# EAGLE design M8340X2 (EAGLE 6.6.0)
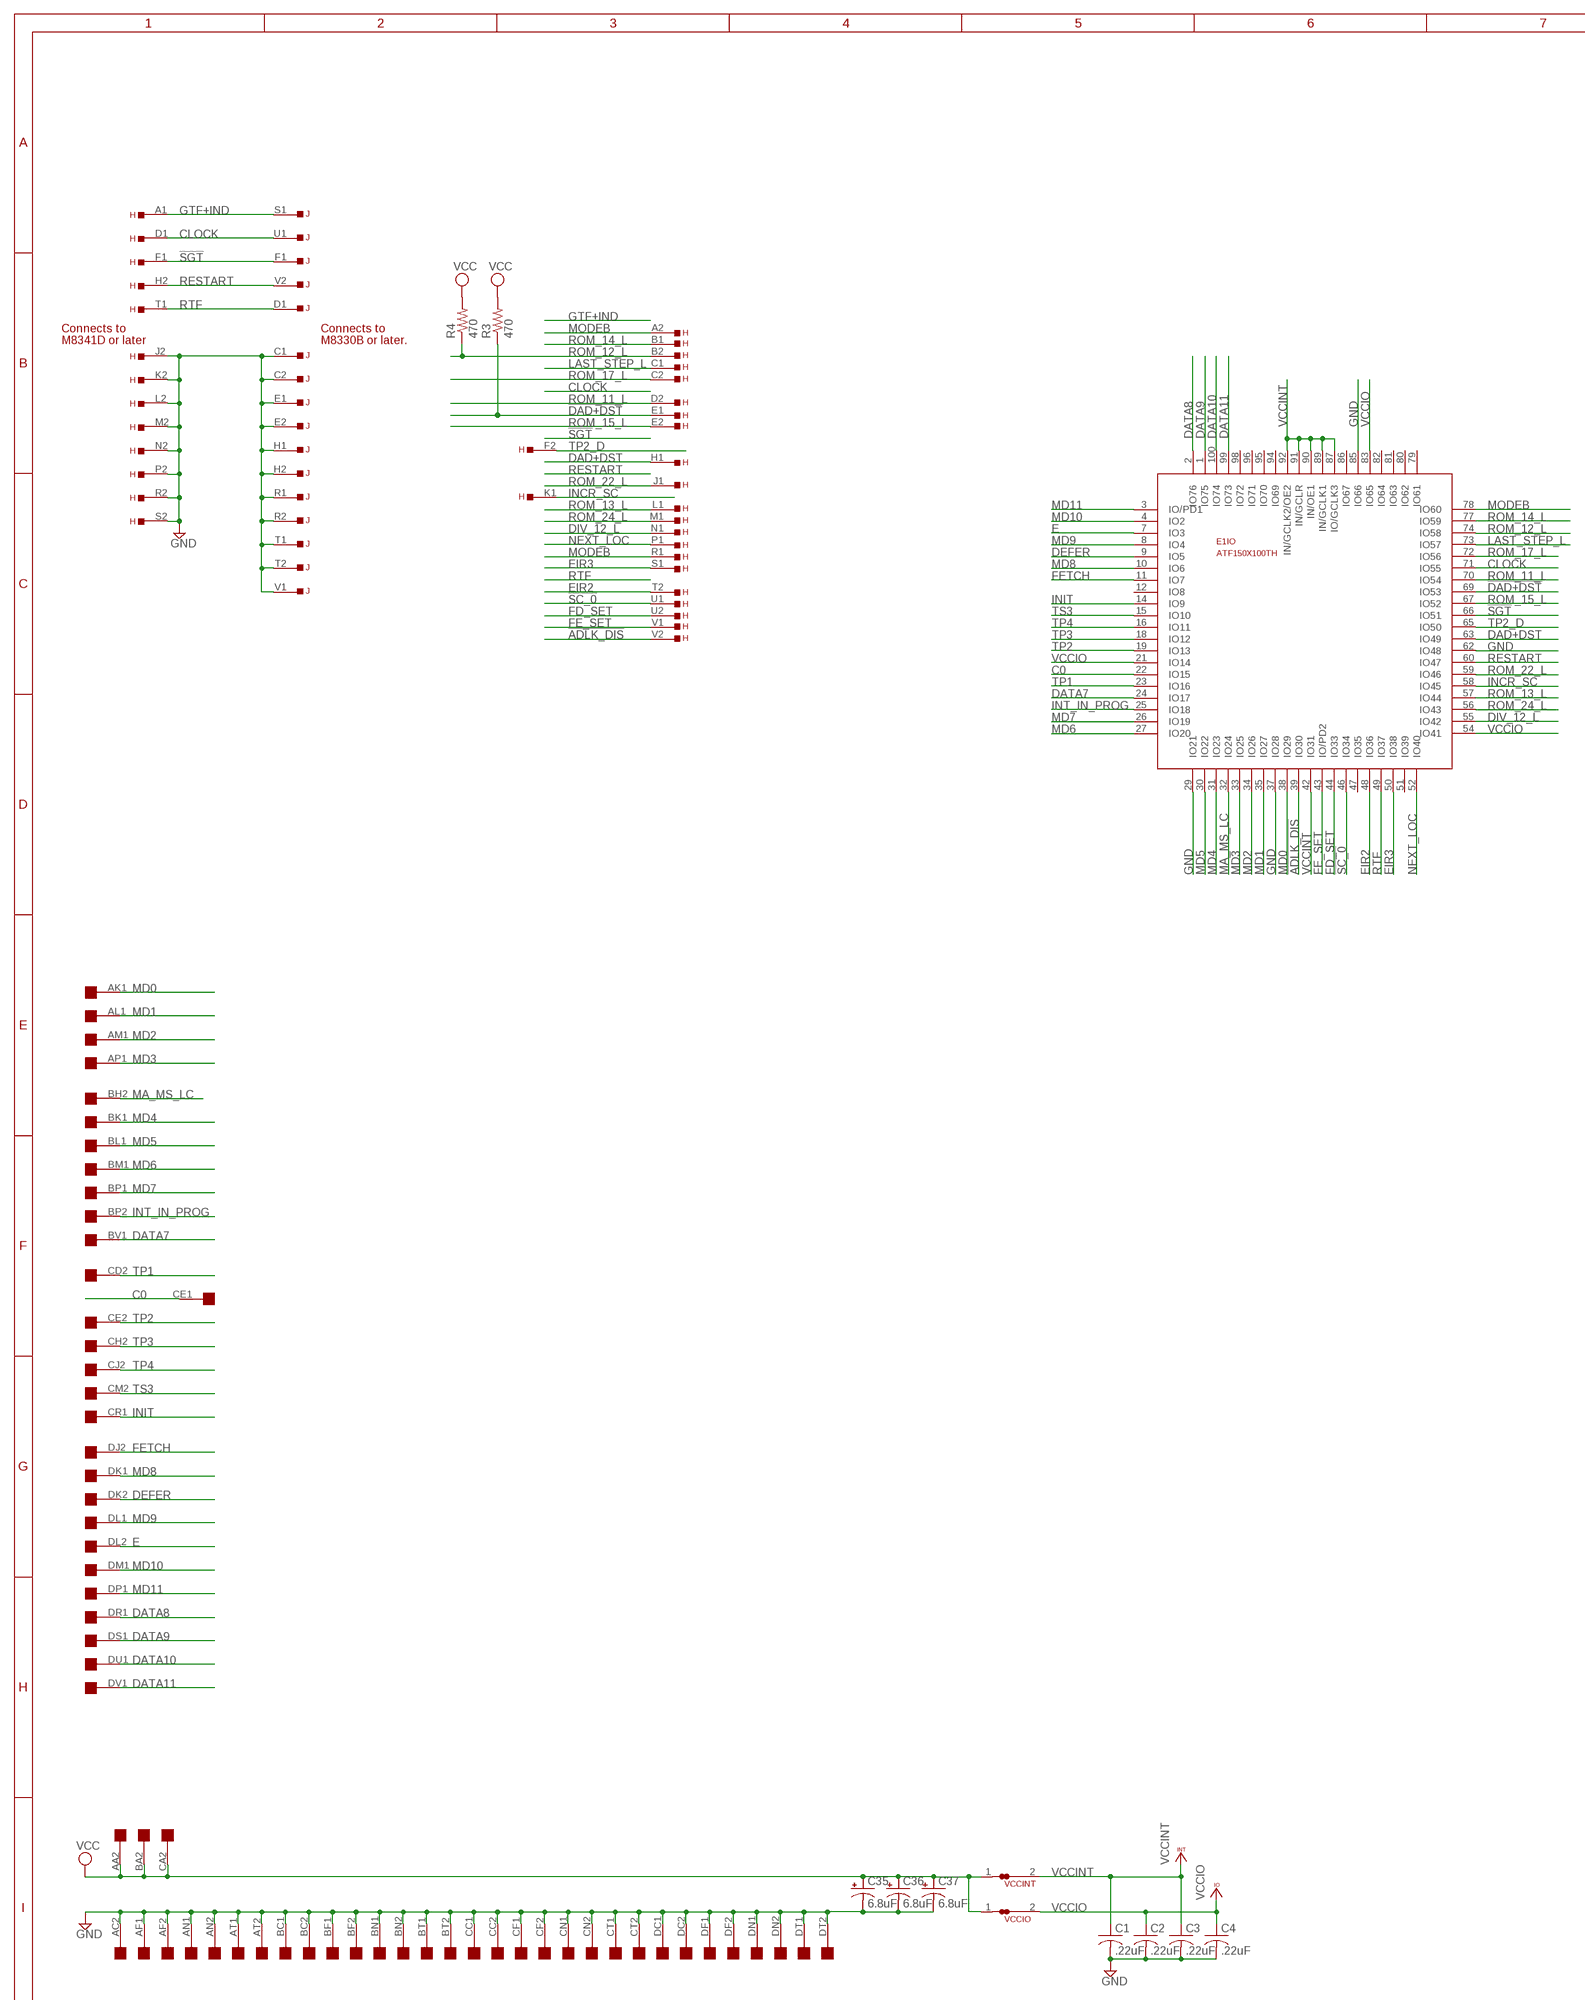
[diagram p0: schematic, sheet 1, part 1 of 2]
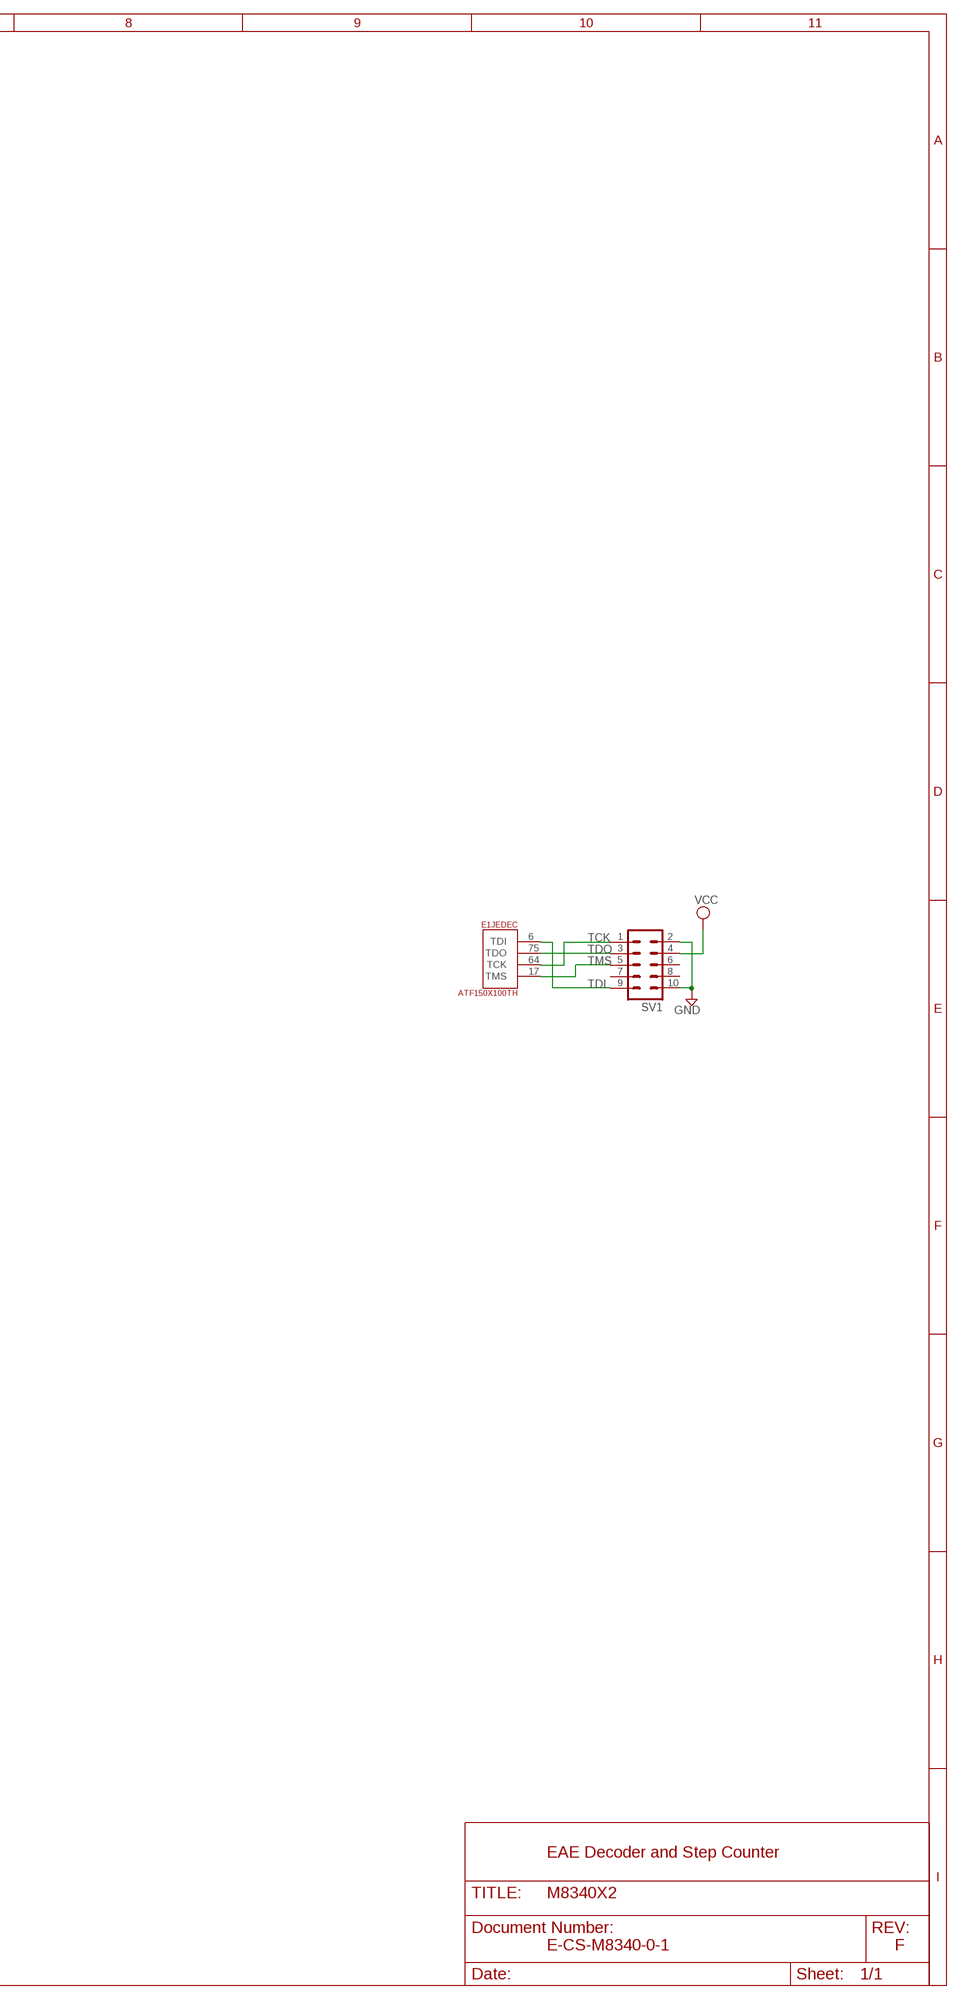
[diagram p1: schematic, sheet 1, part 2 of 2]

## Parts
C1  .22uF  C-US  [C063-025X075]
C2  .22uF  C-US  [C063-025X075]
C3  .22uF  C-US  [C063-025X075]
C4  .22uF  C-US  [C063-025X075]
C35  6.8uF  CPOL-USE20-8AXIAL  [E12-8]
C36  6.8uF  CPOL-USE20-8AXIAL  [E12-8]
C37  6.8uF  CPOL-USE20-8AXIAL  [E12-8]
E1  ATF150X100TH  [TH-100]
H  EDGE-TOP  [EDGE-CON2]
J  EDGE-TOP  [EDGE-CON2]
R3  470  R-US_0207/10  [0207/10]
R4  470  R-US_0207/10  [0207/10]
SV1  ML10  [ML10]
U$1  QUAD  [EDGE-CON8]
VCCINT  JUMPER-NC1  [NC1]
VCCIO  JUMPER-NC1  [NC1]

## Nets
!ADLK_DIS: E1.39(IO:IO30) H.V2
!DAD+DST: E1.69(IO:IO53) H.E1 R3.1
!SC_0: E1.46(IO:IO34) H.U1
!SGT: E1.66(IO:IO51) H.F1 J.F1
C0: E1.22(IO:IO15) U$1.CE1
CLOCK: E1.71(IO:IO55) H.D1 J.U1
DAD+DST: E1.63(IO:IO49) H.H1
DATA7: E1.24(IO:IO17) U$1.BV1
DATA8: E1.2(IO:IO76) U$1.DR1
DATA9: E1.1(IO:IO75) U$1.DS1
DATA10: E1.100(IO:IO74) U$1.DU1
DATA11: E1.99(IO:IO73) U$1.DV1
DEFER: E1.9(IO:IO5) U$1.DK2
DIV_12_L: E1.55(IO:IO42) H.N1
E: E1.7(IO:IO3) U$1.DL2
EIR2: E1.48(IO:IO36) H.T2
EIR3: E1.50(IO:IO38) H.S1
FD_SET: E1.44(IO:IO33) H.U2
FE_SET: E1.43(IO:IO/PD2) H.V1
FETCH: E1.11(IO:IO7) U$1.DJ2
GND [supply]: C1.2 C2.2 C3.2 C4.2 C35.- C36.- C37.- E1.29(IO:IO21) E1.37(IO:IO28) E1.62(IO:IO48) E1.85(IO:IO66) H.J2 H.K2 H.L2 H.M2 H.N2 H.P2 H.R2 H.S2 J.C1 J.C2 J.E1 J.E2 J.H1 J.H2 J.R1 J.R2 J.T1 J.T2 J.V1 SV1.2 SV1.10 U$1.AC2 U$1.AF1 U$1.AF2 U$1.AN1 U$1.AN2 U$1.AT1 U$1.AT2 U$1.BC1 U$1.BC2 U$1.BF1 U$1.BF2 U$1.BN1 U$1.BN2 U$1.BT1 U$1.BT2 U$1.CC1 U$1.CC2 U$1.CF1 U$1.CF2 U$1.CN1 U$1.CN2 U$1.CT1 U$1.CT2 U$1.DC1 U$1.DC2 U$1.DF1 U$1.DF2 U$1.DN1 U$1.DN2 U$1.DT1 U$1.DT2
GTF+IND: H.A1 J.S1
INCR_SC: E1.58(IO:IO45) H.K1
INIT: E1.14(IO:IO9) U$1.CR1
INT_IN_PROG: E1.25(IO:IO18) U$1.BP2
LAST_STEP_L: E1.73(IO:IO57) H.C1
MA_MS_LC: E1.32(IO:IO24) U$1.BH2
MD0: E1.38(IO:IO29) U$1.AK1
MD1: E1.35(IO:IO27) U$1.AL1
MD2: E1.34(IO:IO26) U$1.AM1
MD3: E1.33(IO:IO25) U$1.AP1
MD4: E1.31(IO:IO23) U$1.BK1
MD5: E1.30(IO:IO22) U$1.BL1
MD6: E1.27(IO:IO20) U$1.BM1
MD7: E1.26(IO:IO19) U$1.BP1
MD8: E1.10(IO:IO6) U$1.DK1
MD9: E1.8(IO:IO4) U$1.DL1
MD10: E1.4(IO:IO2) U$1.DM1
MD11: E1.3(IO:IO/PD1) U$1.DP1
MODEB: E1.78(IO:IO60) H.A2 H.R1
NEXT_LOC: E1.52(IO:IO40) H.P1
RESTART: E1.60(IO:IO47) H.H2 J.V2
ROM_11_L: E1.70(IO:IO54) H.D2
ROM_12_L: E1.74(IO:IO58) H.B2 R4.1
ROM_13_L: E1.57(IO:IO44) H.L1
ROM_14_L: E1.77(IO:IO59) H.B1
ROM_15_L: E1.67(IO:IO52) H.E2
ROM_17_L: E1.72(IO:IO56) H.C2
ROM_22_L: E1.59(IO:IO46) H.J1
ROM_24_L: E1.56(IO:IO43) H.M1
RTF: E1.49(IO:IO37) H.T1 J.D1
TCK: E1.64(JEDEC:TCK) SV1.1
TDI: E1.6(JEDEC:TDI) SV1.9
TDO: E1.75(JEDEC:TDO) SV1.3
TMS: E1.17(JEDEC:TMS) SV1.5
TP1: E1.23(IO:IO16) U$1.CD2
TP2: E1.19(IO:IO13) U$1.CE2
TP2_D: E1.65(IO:IO50) H.F2
TP3: E1.18(IO:IO12) U$1.CH2
TP4: E1.16(IO:IO11) U$1.CJ2
TS3: E1.15(IO:IO10) U$1.CM2
VCC [supply]: C35.+ C36.+ C37.+ R3.2 R4.2 SV1.4 U$1.AA2 U$1.BA2 U$1.CA2 VCCINT.1 VCCIO.1
VCCINT: C1.1 C3.1 E1.42(IO:IO31) E1.87(IO:IO/GCLK3) E1.89(IO:IN/GCLK1) E1.90(IO:IN/OE1) E1.91(IO:IN/GCLR) E1.92(IO:IN/GCLK2/OE2) VCCINT.2
VCCIO: C2.1 C4.1 E1.21(IO:IO14) E1.54(IO:IO41) E1.83(IO:IO65) VCCIO.2
Unconnected: E1.12(IO:IO8) E1.47(IO:IO35) E1.51(IO:IO39) E1.79(IO:IO61) E1.80(IO:IO62) E1.81(IO:IO63) E1.82(IO:IO64) E1.86(IO:IO67) E1.94(IO:IO69) E1.95(IO:IO70) E1.96(IO:IO71) E1.98(IO:IO72) J.A1 J.A2 J.B1 J.B2 J.D2 J.F2 J.J1 J.J2 J.K1 J.K2 J.L1 J.L2 J.M1 J.M2 J.N1 J.N2 J.P1 J.P2 J.S2 J.U2 SV1.6 SV1.7 SV1.8 U$1.AA1 U$1.AB1 U$1.AB2 U$1.AC1 U$1.AD1 U$1.AD2 U$1.AE1 U$1.AE2 U$1.AH1 U$1.AH2 U$1.AJ1 U$1.AJ2 U$1.AK2 U$1.AL2 U$1.AM2 U$1.AP2 U$1.AR1 U$1.AR2 U$1.AS1 U$1.AS2 U$1.AU1 U$1.AU2 U$1.AV1 U$1.AV2 U$1.BA1 U$1.BB1 U$1.BB2 U$1.BD1 U$1.BD2 U$1.BE1 U$1.BE2 U$1.BH1 U$1.BJ1 U$1.BJ2 U$1.BK2 U$1.BL2 U$1.BM2 U$1.BR1 U$1.BR2 U$1.BS1 U$1.BS2 U$1.BU1 U$1.BU2 U$1.BV2 U$1.CA1 U$1.CB1 U$1.CB2 U$1.CD1 U$1.CH1 U$1.CJ1 U$1.CK1 U$1.CK2 U$1.CL1 U$1.CL2 U$1.CM1 U$1.CP1 U$1.CP2 U$1.CR2 U$1.CS1 U$1.CS2 U$1.CU1 U$1.CU2 U$1.CV1 U$1.CV2 U$1.DA1 U$1.DA2 U$1.DB1 U$1.DB2 U$1.DD1 U$1.DD2 U$1.DE1 U$1.DE2 U$1.DH1 U$1.DH2 U$1.DJ1 U$1.DM2 U$1.DP2 U$1.DR2 U$1.DS2 U$1.DU2 U$1.DV2

## Notes on the sheet
- Connects to | Connects to
- M8341D or later | M8330B or later.
- EAE Decoder and Step Counter
- E-CS-M8340-0-1 | F

## Power pins joined to a net without a drawn wire
GND: E1.13(GND) E1.28(GND) E1.40(GND) E1.45(GND) E1.61(GND) E1.76(GND) E1.88(GND) E1.97(GND)
VCCINT: E1.41(VCCINT) E1.93(VCCINT)
VCCIO: E1.5(VCCIO) E1.20(VCCIO) E1.36(VCCIO) E1.53(VCCIO) E1.68(VCCIO) E1.84(VCCIO)

## Library data of the parts
C1-C4 = dec-con:C-US: Capacitors with funky DEC lead spacing.
C35-C37 = dec-con:CPOL-USE20-8AXIAL: A 0.8 inch electrolytic.
E1 = atmel-cpld:ATF150X100: ATF150x in 100 pin package.
H J = dec-con:EDGE-TOP: Labeled DEC edge connector, suitable for top connector.
R3 R4 = rcl:R-US_: RESISTOR, American symbol
SV1 = con-harting-ml:ML10: HARTING; OC_FARNELL: unknown; OC_NEWARK: unknown
U$1 = dec-con:QUAD: Quad-Height DEC board
VCCINT VCCIO = dec-con:JUMPER: Normally closed SMD Jumper (Generates a DRC error.)

## Net classes
0 default: width 0.406 mm
1 supply: width 0.61 mm

## Board
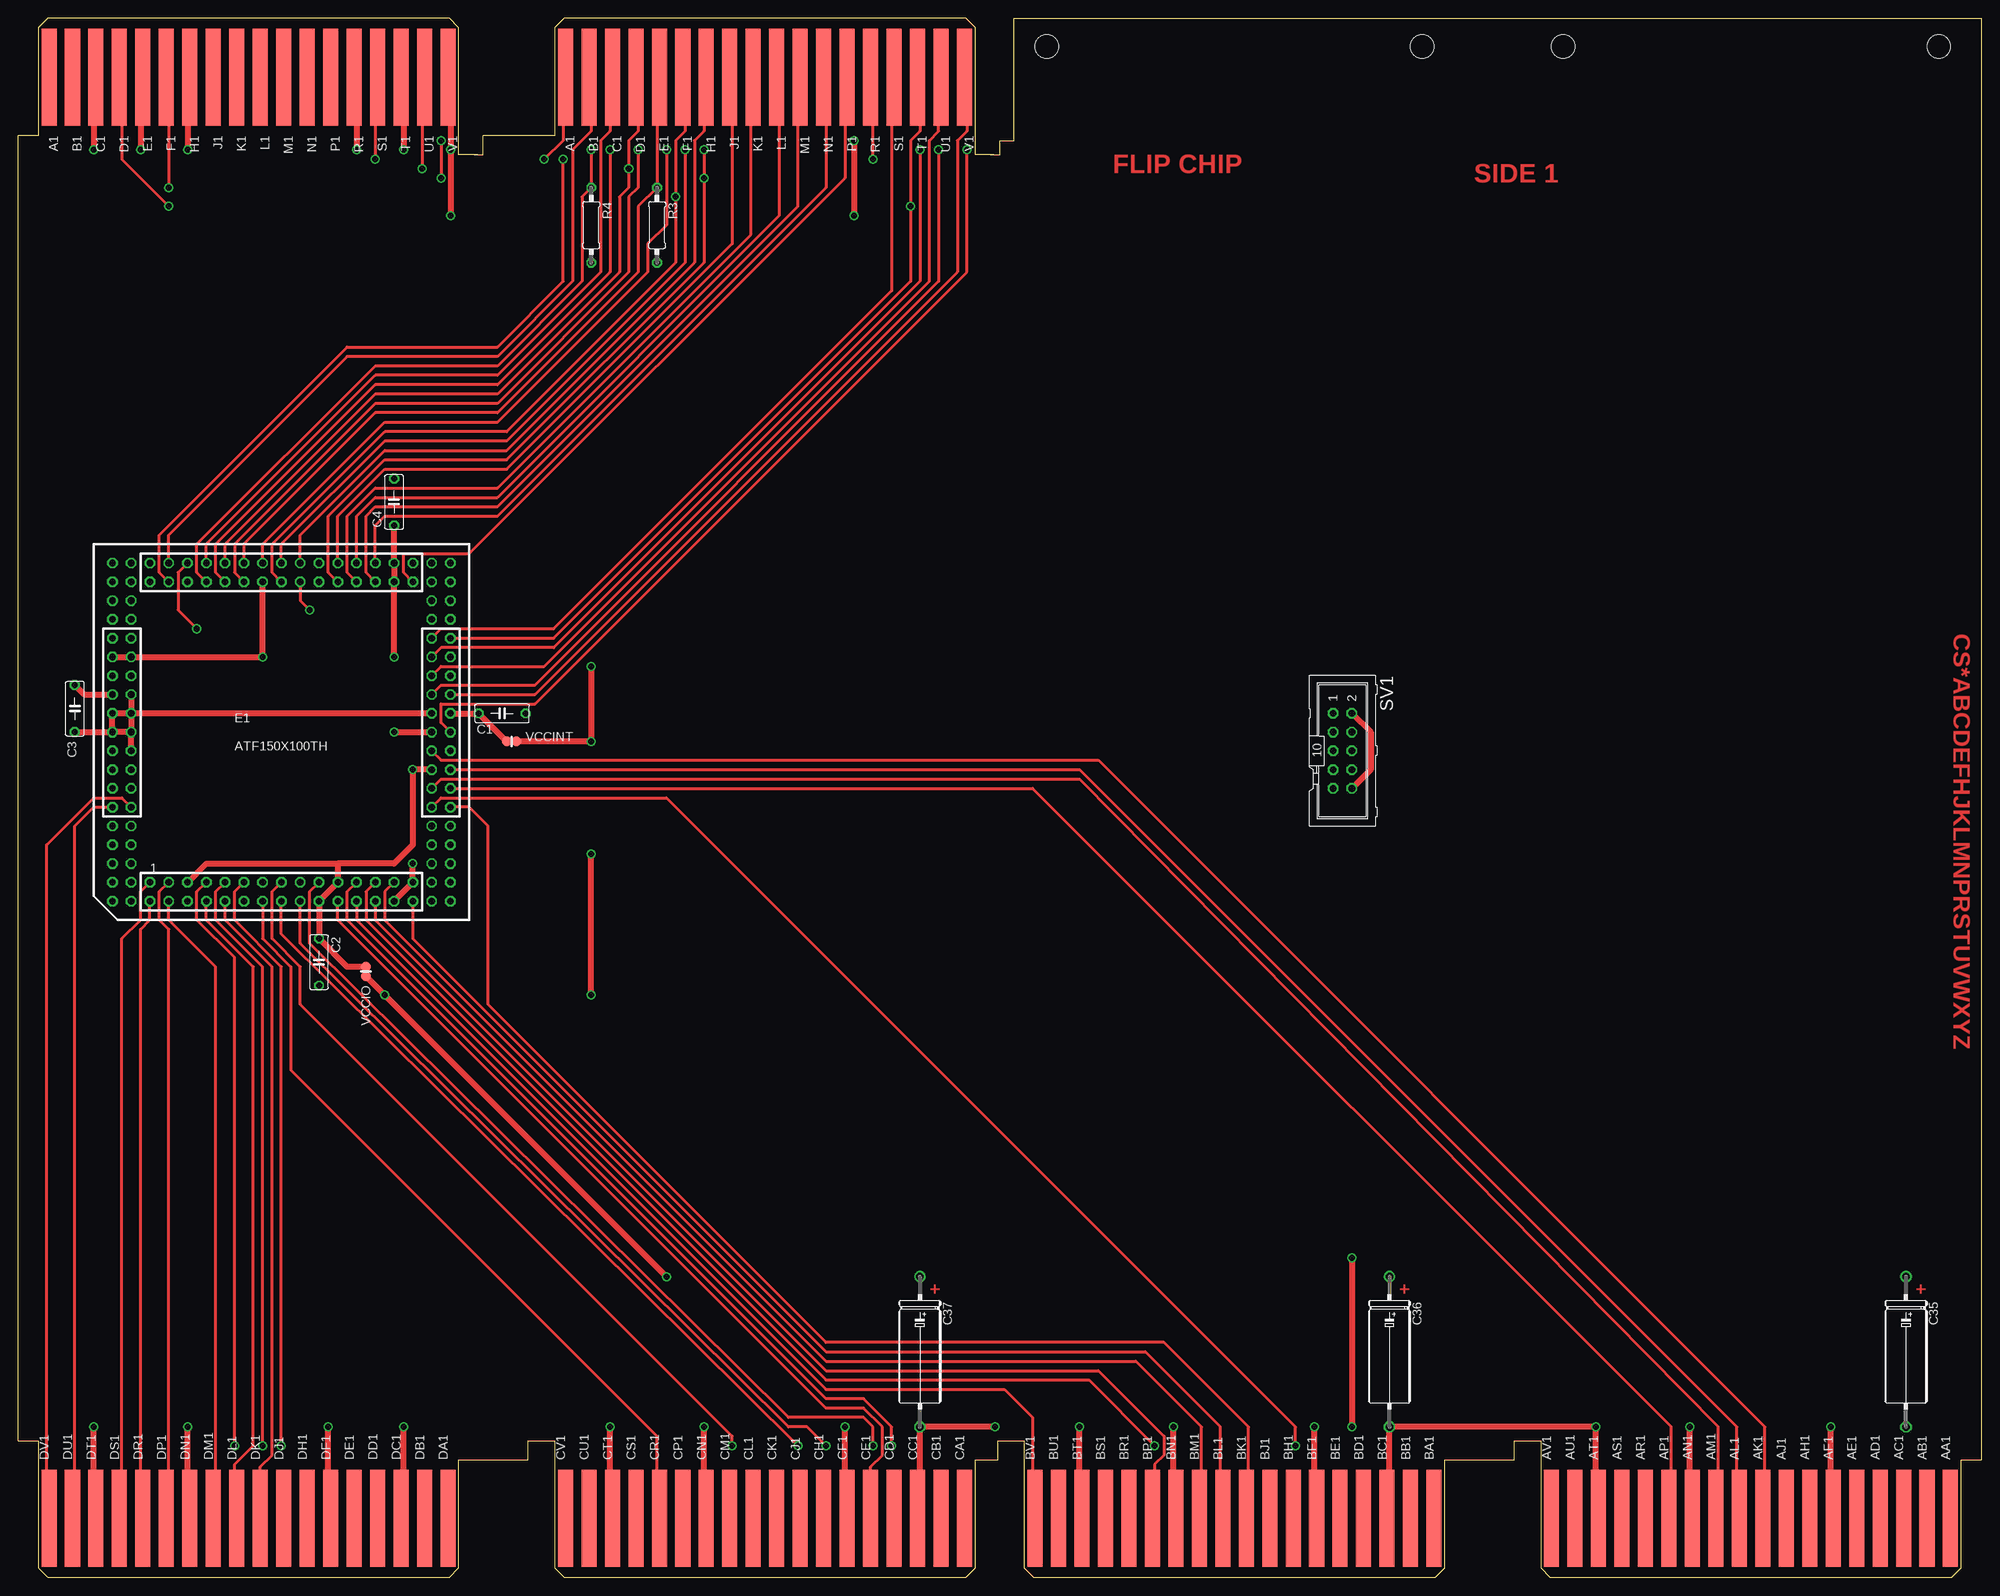
[diagram p2: board, top side]
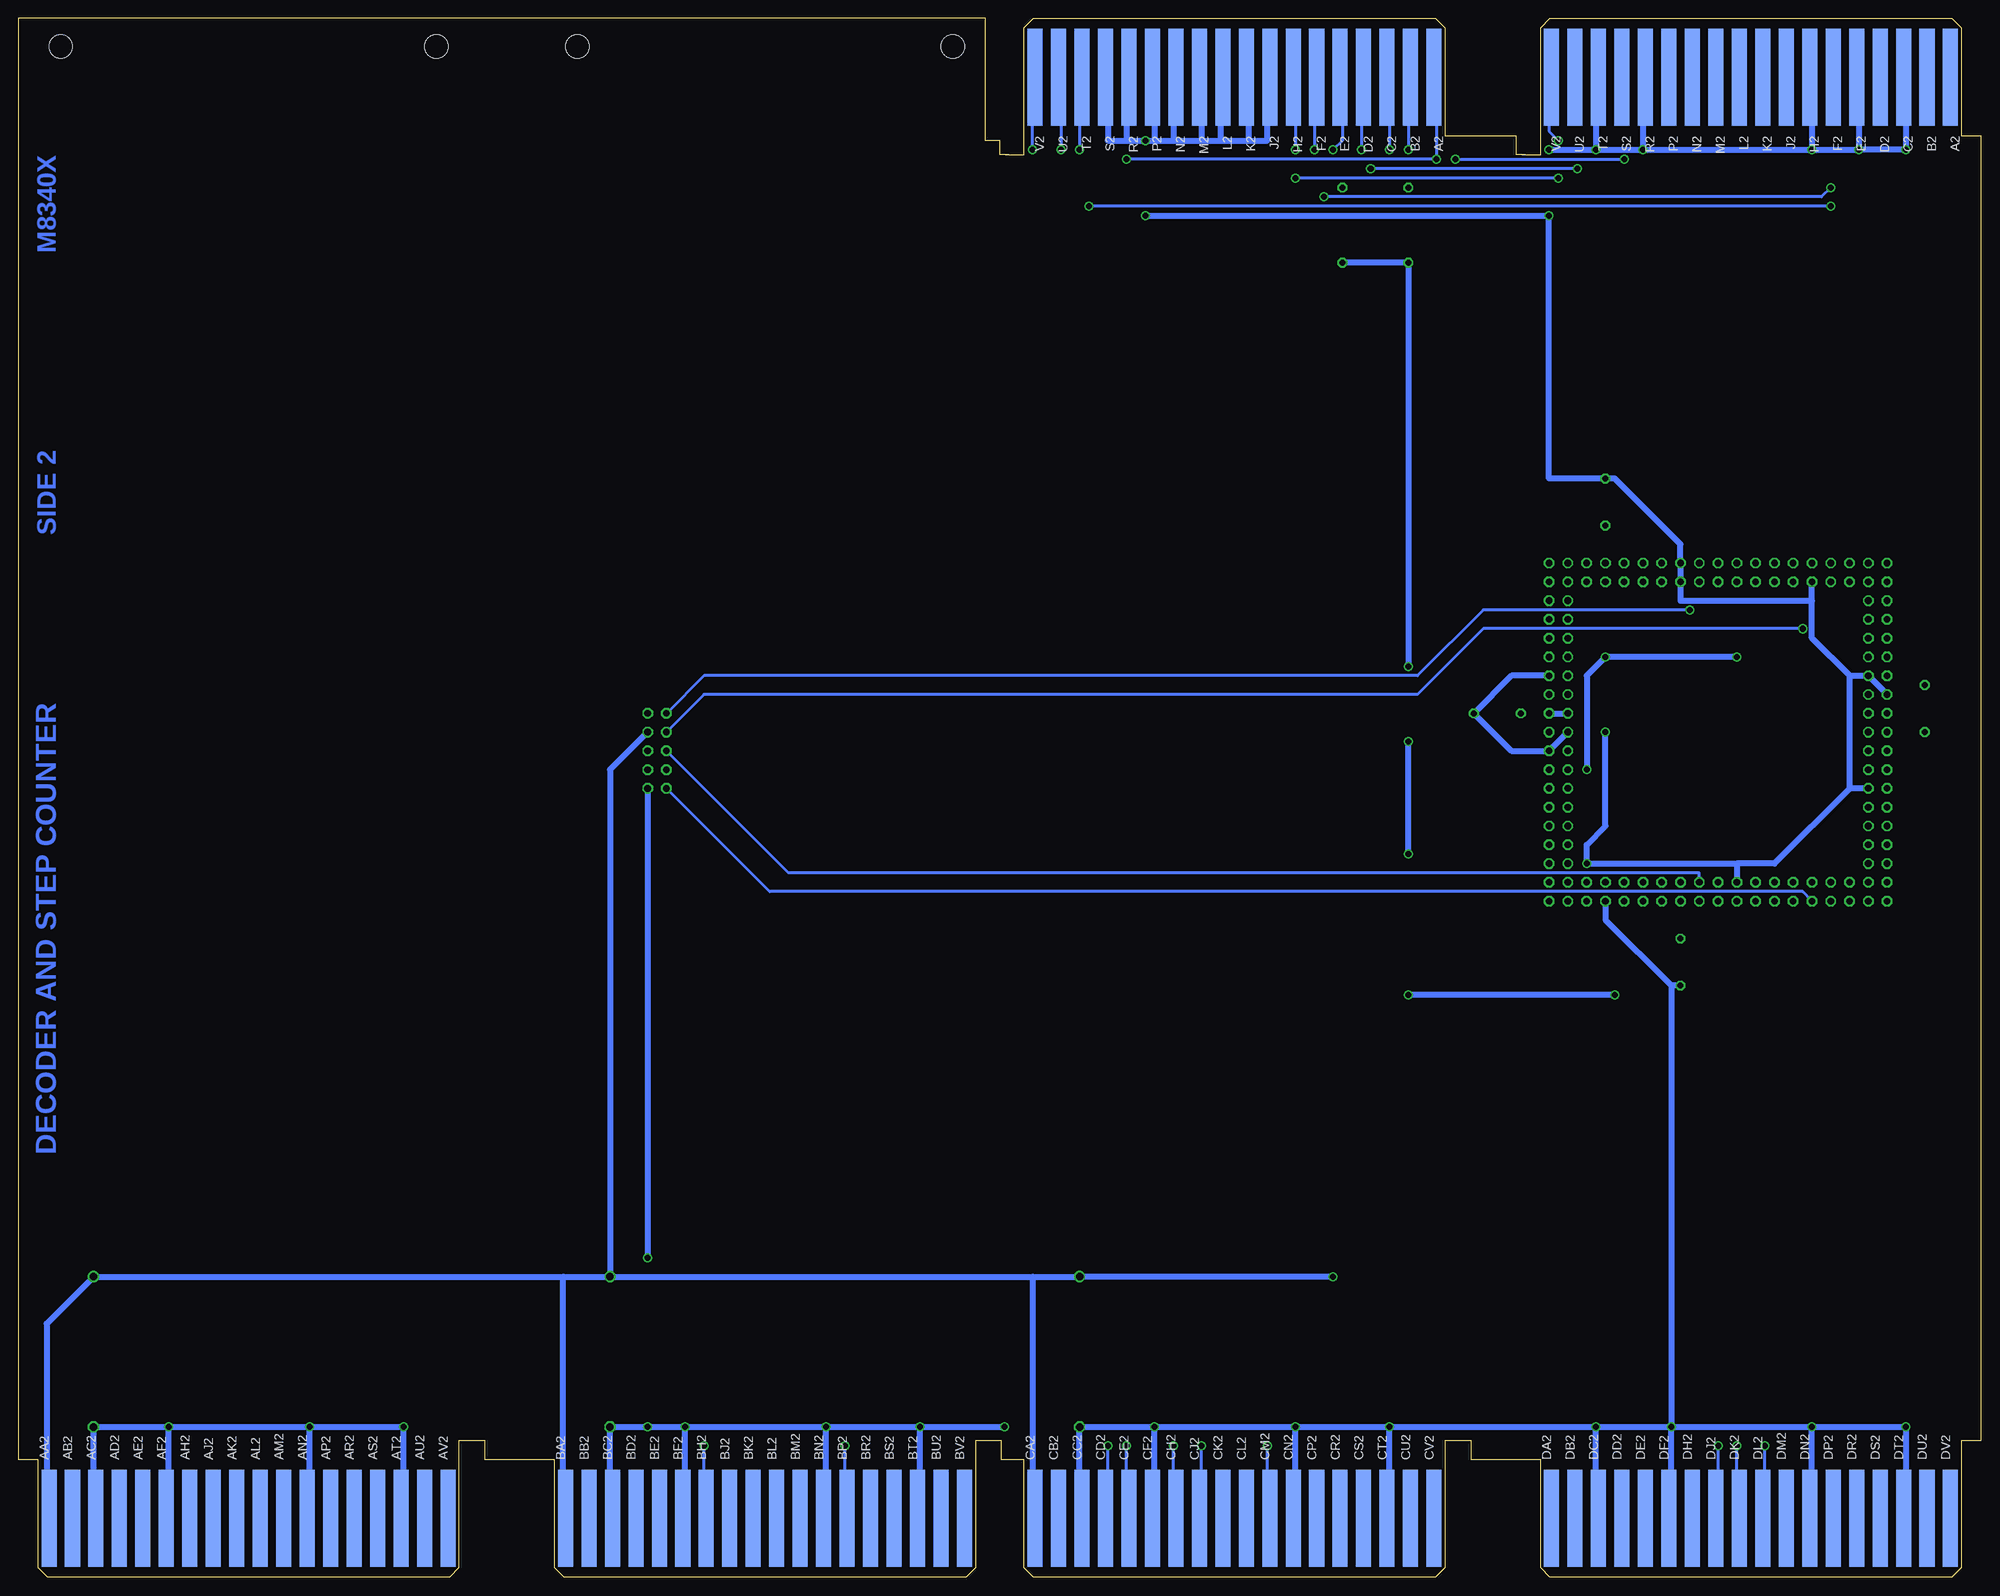
[diagram p3: board, bottom side, seen from below]

Size 265.43 x 210.82 mm. Coordinates in mm from the lower left corner, seen from the top.
Outline: 61.59,192.41 62.87,192.41 62.87,194.94 69.85,194.94
Outline: 131.44,192.41 132.72,192.41 132.72,194.31 134.62,194.31 134.62,210.82 265.43,210.82 265.43,15.88
Outline: 0,194.94 0,18.41 0.64,18.41
Copper layers (1+16): Top 0.035mm / dielectric 1.5mm / Bottom 0.035mm
Design rules "16mils": minimum track width 16mil, minimum drill 32mil, track to track 15mil, track to pad 10mil, pad to pad 10mil, via to via 10mil, smd to smd 10mil, copper to edge 13mil, drill to drill 10mil, minimum pad ring 10mil, minimum via ring 8mil, stop-mask expansion 0mil, vias tented up to drill 0mil, thermal gap 10mil
Holes 3.2 mm at 139.06,207.01 189.87,207.01 208.91,207.01 259.71,207.01

### Footprints (pad centres in the part's own frame; a part is rotated, then mirrored left to right if it is on the bottom)
C063-025X075 = drill 0.813 octagon: 1 -2.54,0; 2 3.81,0
E12-8 = drill 1.016: + -10.16,0 | drill 1.016 octagon: - 10.16,0
TH-100 = drill 0.9 octagon: 1 -17.78,-20.32; 2 -17.78,-22.86; 3 -15.24,-20.32; 4 -15.24,-22.86; 5 -12.7,-20.32; 6 -12.7,-22.86; 7 -10.16,-20.32; 8 -10.16,-22.86; 9 -7.62,-20.32; 10 -7.62,-22.86; 11 -5.08,-20.32; 12 -5.08,-22.86; 13 -2.54,-20.32; 14 -2.54,-22.86; 15 0,-20.32; 16 0,-22.86; 17 2.54,-20.32; 18 2.54,-22.86; 19 5.08,-20.32; 20 5.08,-22.86; 21 7.62,-20.32; 22 7.62,-22.86; 23 10.16,-20.32; 24 10.16,-22.86; 25 12.7,-20.32; 26 12.7,-22.86; 27 15.24,-20.32; 28 15.24,-22.86; 29 17.78,-20.32; 30 17.78,-22.86; 31 22.86,-10.16; 32 20.32,-10.16; 33 22.86,-7.62; 34 20.32,-7.62; 35 22.86,-5.08; 36 20.32,-5.08; 37 22.86,-2.54; 38 20.32,-2.54; 39 22.86,0; 40 20.32,0; 41 22.86,2.54; 42 20.32,2.54; 43 22.86,5.08; 44 20.32,5.08; 45 22.86,7.62; 46 20.32,7.62; 47 22.86,10.16; 48 20.32,10.16; 49 22.86,12.7; 50 20.32,12.7; 51 17.78,22.86; 52 17.78,20.32; 53 15.24,22.86; 54 15.24,20.32; 55 12.7,22.86; 56 12.7,20.32; 57 10.16,22.86; 58 10.16,20.32; 59 7.62,22.86; 60 7.62,20.32; 61 5.08,22.86; 62 5.08,20.32; 63 2.54,22.86; 64 2.54,20.32; 65 0,22.86; 66 0,20.32; 67 -2.54,22.86; 68 -2.54,20.32; 69 -5.08,22.86; 70 -5.08,20.32; 71 -7.62,22.86; 72 -7.62,20.32; 73 -10.16,22.86; 74 -10.16,20.32; 75 -12.7,22.86; 76 -12.7,20.32; 77 -15.24,22.86; 78 -15.24,20.32; 79 -17.78,22.86; 80 -17.78,20.32; 81 -20.32,12.7; 82 -22.86,12.7; 83 -20.32,10.16; 84 -22.86,10.16; 85 -20.32,7.62; 86 -22.86,7.62; 87 -20.32,5.08; 88 -22.86,5.08; 89 -20.32,2.54; 90 -22.86,2.54; 91 -20.32,0; 92 -22.86,0; 93 -20.32,-2.54; 94 -22.86,-2.54; 95 -20.32,-5.08; 96 -22.86,-5.08; 97 -20.32,-7.62; 98 -22.86,-7.62; 99 -20.32,-10.16; 100 -22.86,-10.16; P$1 -22.86,15.24; P$2 -20.32,15.24; P$3 -20.32,17.78; P$4 -22.86,17.78; P$5 -20.32,20.32; P$6 -22.86,20.32; P$7 -22.86,22.86; P$8 -20.32,22.86; P$9 20.32,15.24; P$10 22.86,15.24; P$11 20.32,17.78; P$12 22.86,17.78; P$13 20.32,20.32; P$14 22.86,20.32; P$15 20.32,22.86; P$16 22.86,22.86; P$17 20.32,-17.78; P$18 22.86,-17.78; P$19 20.32,-15.24; P$20 22.86,-15.24; P$21 20.32,-12.7; P$22 22.86,-12.7; P$31 20.32,-22.86; P$32 22.86,-22.86; P$33 22.86,-20.32; P$34 20.32,-20.32; P$35 -20.32,-22.86; P$36 -20.32,-20.32; P$37 -22.86,-20.32; P$38 -22.86,-22.86; P$39 -22.86,-17.78; P$40 -20.32,-17.78; P$41 -22.86,-15.24; P$42 -20.32,-15.24; P$43 -22.86,-12.7; P$44 -20.32,-12.7
EDGE-CON2 = smd 13.106 x 2.032: A1 7.938,4.128; B1 7.938,7.303; C1 7.938,10.477; D1 7.938,13.652; E1 7.938,16.828; F1 7.938,20.003; H1 7.938,23.177; J1 7.938,26.352; K1 7.938,29.527; L1 7.938,32.703; M1 7.938,35.877; N1 7.938,39.053; P1 7.938,42.227; R1 7.938,45.403; S1 7.938,48.578; T1 7.938,51.752; U1 7.938,54.928; V1 7.938,58.102 | smd 13.106 x 2.032 bottom: A2 7.938,4.128; B2 7.938,7.303; C2 7.938,10.477; D2 7.938,13.652; E2 7.938,16.828; F2 7.938,20.003; H2 7.938,23.177; J2 7.938,26.352; K2 7.938,29.527; L2 7.938,32.703; M2 7.938,35.877; N2 7.938,39.053; P2 7.938,42.227; R2 7.938,45.403; S2 7.938,48.578; T2 7.938,51.752; U2 7.938,54.928; V2 7.938,58.102
0207/10 = drill 0.813 octagon: 1 -5.08,0; 2 5.08,0
ML10 = drill 0.914 octagon: 1 -5.08,-1.27; 2 -5.08,1.27; 3 -2.54,-1.27; 4 -2.54,1.27; 5 0,-1.27; 6 0,1.27; 7 2.54,-1.27; 8 2.54,1.27; 9 5.08,-1.27; 10 5.08,1.27
EDGE-CON8 = smd 2.032 x 13.106: AA1 261.303,7.938; AB1 258.127,7.938; AC1 254.952,7.938; AD1 251.778,7.938; AE1 248.602,7.938; AF1 245.428,7.938; AH1 242.252,7.938; AJ1 239.077,7.938; AK1 235.903,7.938; AL1 232.727,7.938; AM1 229.553,7.938; AN1 226.377,7.938; AP1 223.202,7.938; AR1 220.028,7.938; AS1 216.852,7.938; AT1 213.678,7.938; AU1 210.502,7.938; AV1 207.327,7.938; BA1 191.452,7.938; BB1 188.278,7.938; BC1 185.102,7.938; BD1 181.928,7.938; BE1 178.752,7.938; BF1 175.577,7.938; BH1 172.403,7.938; BJ1 169.227,7.938; BK1 166.053,7.938; BL1 162.877,7.938; BM1 159.702,7.938; BN1 156.528,7.938; BP1 153.352,7.938; BR1 150.178,7.938; BS1 147.002,7.938; BT1 143.827,7.938; BU1 140.653,7.938; BV1 137.477,7.938; CA1 127.953,7.938; CB1 124.778,7.938; CC1 121.603,7.938; CD1 118.427,7.938; CE1 115.252,7.938; CF1 112.078,7.938; CH1 108.903,7.938; CJ1 105.728,7.938; CK1 102.552,7.938; CL1 99.377,7.938; CM1 96.203,7.938; CN1 93.028,7.938; CP1 89.853,7.938; CR1 86.677,7.938; CS1 83.502,7.938; CT1 80.328,7.938; CU1 77.153,7.938; CV1 73.978,7.938; DA1 58.102,7.938; DB1 54.928,7.938; DC1 51.752,7.938; DD1 48.578,7.938; DE1 45.403,7.938; DF1 42.227,7.938; DH1 39.053,7.938; DJ1 35.877,7.938; DK1 32.703,7.938; DL1 29.527,7.938; DM1 26.352,7.938; DN1 23.177,7.938; DP1 20.003,7.938; DR1 16.828,7.938; DS1 13.652,7.938; DT1 10.477,7.938; DU1 7.303,7.938; DV1 4.128,7.938 | smd 2.032 x 13.106 bottom: AA2 261.303,7.938; AB2 258.127,7.938; AC2 254.952,7.938; AD2 251.778,7.938; AE2 248.602,7.938; AF2 245.428,7.938; AH2 242.252,7.938; AJ2 239.077,7.938; AK2 235.903,7.938; AL2 232.727,7.938; AM2 229.553,7.938; AN2 226.377,7.938; AP2 223.202,7.938; AR2 220.028,7.938; AS2 216.852,7.938; AT2 213.678,7.938; AU2 210.502,7.938; AV2 207.327,7.938; BA2 191.452,7.938; BB2 188.278,7.938; BC2 185.102,7.938; BD2 181.928,7.938; BE2 178.752,7.938; BF2 175.577,7.938; BH2 172.403,7.938; BJ2 169.227,7.938; BK2 166.053,7.938; BL2 162.877,7.938; BM2 159.702,7.938; BN2 156.528,7.938; BP2 153.352,7.938; BR2 150.178,7.938; BS2 147.002,7.938; BT2 143.827,7.938; BU2 140.653,7.938; BV2 137.477,7.938; CA2 127.953,7.938; CB2 124.778,7.938; CC2 121.603,7.938; CD2 118.427,7.938; CE2 115.252,7.938; CF2 112.078,7.938; CH2 108.903,7.938; CJ2 105.728,7.938; CK2 102.552,7.938; CL2 99.377,7.938; CM2 96.203,7.938; CN2 93.028,7.938; CP2 89.853,7.938; CR2 86.677,7.938; CS2 83.502,7.938; CT2 80.328,7.938; CU2 77.153,7.938; CV2 73.978,7.938; DA2 58.102,7.938; DB2 54.928,7.938; DC2 51.752,7.938; DD2 48.578,7.938; DE2 45.403,7.938; DF2 42.227,7.938; DH2 39.053,7.938; DJ2 35.877,7.938; DK2 32.703,7.938; DL2 29.527,7.938; DM2 26.352,7.938; DN2 23.177,7.938; DP2 20.003,7.938; DR2 16.828,7.938; DS2 13.652,7.938; DT2 10.477,7.938; DU2 7.303,7.938; DV2 4.128,7.938
NC1 = smd 1.346 x 1.346: 1 -0.635,0; 2 0.635,0

### Placement (x,y rotation side)
C1  64.77,116.84 0 top
C2  40.64,83.82 270 top
C3  7.62,116.84 90 top
C4  50.8,144.78 90 top
C35  255.27,30.48 270 top
C36  185.42,30.48 270 top
C37  121.92,30.48 270 top
E1  35.56,114.3 0 top
H  69.85,210.82 270 top
J  0,210.82 270 top
R3  86.36,182.88 270 top
R4  77.47,182.88 270 top
SV1  179.07,111.76 270 top
U$1  0,0 0 top
VCCINT  66.67,113.03 180 top
VCCIO  46.99,81.92 90 top

### Tracks (layer width: path | path; a pad name or v marks a point on that pad's centre or on a via)
!ADLK_DIS  (via drill 0.81 pad 0.25)
  Top 0.406: E1.39 57.15,115.57 57.15,118.11 69.85,118.11 128.27,176.53 v128.27,193.04
  Bottom 0.406: v128.27,193.04 128.27,202.56 H.V2
!DAD+DST
  Top 0.406: H.E1 86.68,202.25 86.36,201.93 R3.1 83.82,185.42 83.82,176.53 64.77,157.48 48.26,157.48 30.48,139.7 E1.69
!SC_0
  Top 0.406: E1.46 57.15,123.19 71.12,123.19 123.19,175.26 123.19,194.31 124.46,195.58 124.46,202.56 H.U1
!SGT  (via drill 0.81 pad 0.3)
  Top 0.406: E1.66 34.29,135.89 34.29,139.7 35.56,140.97 49.53,154.94 66.04,154.94 88.9,177.8 v88.9,186.69 88.9,194.31 90.17,195.58 90.17,201.93 89.85,202.25 H.F1 | J.F1 20,202.25 20.32,201.93 v20.32,187.96
  Bottom 0.406: v20.32,187.96 21.59,186.69 v88.9,186.69
C0
  Top 0.406: U$1.CE1 115.25,14.92 116.84,16.51 116.84,20.32 114.3,22.86 109.22,22.86 43.18,88.9 E1.22
CLOCK  (via drill 0.81 pad 0.3)
  Top 0.406: E1.71 27.94,139.7 48.26,160.02 64.77,160.02 81.28,176.53 81.28,186.69 82.55,187.96 v82.55,190.5 82.55,194.31 83.82,195.58 83.82,200.66 83.5,200.98 H.D1 | J.U1 54.93,202.25 54.61,201.93 v54.61,190.5
  Bottom 0.406: v54.61,190.5 v82.55,190.5
DAD+DST
  Top 0.406: H.H1 93.03,200.98 92.71,200.66 92.71,195.58 91.44,194.31 91.44,177.8 66.04,152.4 49.53,152.4 38.1,140.97 E1.63
DATA7
  Top 0.406: E1.24 45.72,88.9 109.22,25.4 133.35,25.4 137.16,21.59 137.16,8.26 U$1.BV1
DATA8
  Top 0.406: U$1.DR1 16.83,9.84 16.51,10.16 16.51,87.63 17.78,88.9 E1.2
DATA9
  Top 0.406: U$1.DS1 13.65,8.57 13.97,8.89 13.97,86.36 16.51,88.9 16.51,92.71 E1.1
DATA10
  Top 0.406: U$1.DU1 7.3,8.57 7.62,8.89 7.62,101.6 10.16,104.14 E1.100
DATA11
  Top 0.406: U$1.DV1 3.81,7.94 3.81,99.06 10.16,105.41 13.97,105.41 E1.99
DEFER  (via drill 0.81 pad 0.25)
  Top 0.406: v33.02,17.78 33.02,82.55 26.67,88.9 26.67,92.71 E1.9
  Bottom 0.406: U$1.DK2 32.7,9.84 33.02,10.16 v33.02,17.78
DIV_12_L
  Top 0.406: H.N1 108.9,200.98 109.22,200.66 109.22,187.96 64.77,143.51 49.53,143.51 48.26,142.24 E1.55
E  (via drill 0.81 pad 0.25)
  Top 0.406: v29.21,17.78 29.21,83.82 24.13,88.9 24.13,92.71 E1.7
  Bottom 0.406: U$1.DL2 29.53,9.84 29.21,10.16 v29.21,17.78
EIR2  (via drill 0.81 pad 0.25)
  Top 0.406: v121.92,193.04 121.92,175.26 72.39,125.73 57.15,125.73 E1.48
  Bottom 0.406: H.T2 121.6,200.98 121.92,200.66 v121.92,193.04
EIR3
  Top 0.406: E1.50 57.15,128.27 72.39,128.27 118.11,173.99 118.11,201.93 118.43,202.25 H.S1
FD_SET  (via drill 0.81 pad 0.25)
  Top 0.406: E1.44 57.15,120.65 69.85,120.65 124.46,175.26 v124.46,193.04
  Bottom 0.406: H.U2 124.78,200.98 124.46,200.66 v124.46,193.04
FE_SET
  Top 0.406: H.V1 127.95,200.98 128.27,200.66 128.27,195.58 127,194.31 127,176.53 69.85,119.38 E1.43
FETCH  (via drill 0.81 pad 0.25)
  Top 0.406: v35.56,17.78 35.56,82.55 29.21,88.9 29.21,92.71 E1.11
  Bottom 0.406: U$1.DJ2 35.88,8.57 35.56,8.89 v35.56,17.78
GND  (via drill 0.81 pad 0.25, 0.81 pad 0.3)
  Top 0.813: C3.2 8.89,119.38 E1.88 | U$1.DT2 10.48,8.57 10.16,8.89 v10.16,20.32 | U$1.DN2 23.18,8.57 22.86,8.89 v22.86,20.32 | U$1.DF2 42.23,8.57 41.91,8.89 v41.91,20.32 | U$1.DC2 51.75,8.57 52.07,8.89 v52.07,20.32 | U$1.CT2 80.33,8.57 80.01,8.89 v80.01,20.32 | U$1.CN2 93.03,8.57 92.71,8.89 v92.71,20.32 | U$1.CF2 112.08,8.57 111.76,8.89 v111.76,20.32 | U$1.CC2 121.6,8.57 121.92,8.89 C37.- v132.08,20.32 | U$1.BT2 143.83,8.57 143.51,8.89 v143.51,20.32 | U$1.BN2 156.53,8.57 156.21,8.89 v156.21,20.32 | U$1.BF2 175.58,8.57 175.26,8.89 v175.26,20.32 | U$1.BC2 185.1,8.57 185.42,8.89 C36.- v213.36,20.32 213.36,8.89 213.68,8.57 U$1.AT1 | U$1.AN1 226.38,8.57 226.06,8.89 v226.06,20.32 | U$1.AF1 245.43,8.57 245.11,8.89 v245.11,20.32 | J.C2 10.48,202.25 10.16,201.93 v10.16,193.04 | J.E1 16.83,202.25 16.51,201.93 v16.51,193.04 | J.H1 23.18,202.25 22.86,201.93 v22.86,193.04 | J.R1 45.4,202.25 45.72,201.93 v45.72,193.04 | J.T1 51.75,202.25 52.07,201.93 v52.07,193.04 | J.V1 58.1,202.25 58.42,201.93 v58.42,193.04 v58.42,184.15 | SV1.2 182.88,114.3 182.88,109.22 SV1.10 | v180.34,43.18 v180.34,20.32 | v113.03,194.31 v113.03,184.15 | E1.28 E1.29 v53.34,96.52 | v50.8,114.3 E1.40
  Bottom 0.813: v111.76,20.32 C37.- 121.92,8.89 121.6,8.57 U$1.CC2 | v111.76,20.32 v92.71,20.32 | v92.71,20.32 v80.01,20.32 | v80.01,20.32 v52.07,20.32 | v52.07,20.32 v41.91,20.32 | v41.91,20.32 v22.86,20.32 | v22.86,20.32 v10.16,20.32 10.16,8.26 U$1.DT2 | C2.2 41.91,80.01 | 41.91,80.01 v41.91,20.32 | v143.51,20.32 v132.08,20.32 | v175.26,20.32 v180.34,20.32 C36.- 185.42,8.89 185.1,8.57 U$1.BC2 | v175.26,20.32 v156.21,20.32 | v156.21,20.32 v143.51,20.32 | v245.11,20.32 C35.- 255.27,8.89 254.95,8.57 U$1.AC2 | v245.11,20.32 v226.06,20.32 | v226.06,20.32 v213.36,20.32 213.36,8.89 213.68,8.57 U$1.AT1 | U$1.CF2 112.08,8.57 111.76,8.89 v111.76,20.32 | U$1.CN2 93.03,8.57 92.71,8.89 v92.71,20.32 | U$1.CT2 80.33,8.57 80.01,8.89 v80.01,20.32 | U$1.DC2 51.75,8.57 52.07,8.89 v52.07,20.32 | U$1.DF2 42.23,8.57 41.91,8.89 v41.91,20.32 | U$1.DN2 23.18,8.57 22.86,8.89 v22.86,20.32 | E1.28 50.8,88.9 41.91,80.01 | U$1.BT2 143.83,8.57 143.51,8.89 v143.51,20.32 | U$1.BN2 156.53,8.57 156.21,8.89 v156.21,20.32 | U$1.AN1 226.38,8.57 226.06,8.89 v226.06,20.32 | U$1.AF1 245.43,8.57 245.11,8.89 v245.11,20.32 | U$1.BF2 175.58,8.57 175.26,8.89 v175.26,20.32 | H.S2 118.43,202.25 118.11,201.93 118.11,194.31 115.57,194.31 | 115.57,194.31 v113.03,194.31 111.76,194.31 | 111.76,194.31 109.22,194.31 | 109.22,194.31 105.41,194.31 | 105.41,194.31 102.87,194.31 | 102.87,194.31 99.06,194.31 | 99.06,194.31 96.52,194.31 96.52,202.56 H.J2 | H.K2 99.38,202.25 99.06,201.93 99.06,194.31 | H.R2 115.25,202.25 115.57,201.93 115.57,194.31 | H.P2 112.08,200.98 111.76,200.66 111.76,194.31 | H.N2 108.9,200.98 109.22,200.66 109.22,194.31 | H.L2 102.55,202.25 102.87,201.93 102.87,194.31
  Bottom 0.813: H.M2 105.73,202.25 105.41,201.93 105.41,194.31 | v52.07,193.04 v45.72,193.04 | v45.72,193.04 v22.86,193.04 | v22.86,193.04 v16.51,193.04 | v16.51,193.04 v10.16,193.04 10.16,201.93 10.48,202.25 J.C2 | J.E1 16.83,202.25 16.51,201.93 v16.51,193.04 | J.H1 23.18,202.25 22.86,201.93 v22.86,193.04 | J.R1 45.4,202.25 45.72,201.93 v45.72,193.04 | J.T1 51.75,202.25 52.07,201.93 v52.07,193.04 | v58.42,193.04 v52.07,193.04 | SV1.10 v180.34,43.18 | v113.03,184.15 v58.42,184.15 58.42,148.59 C4.2 49.53,148.59 40.64,139.7 E1.61 E1.62 40.64,132.08 22.86,132.08 | E1.88 E1.85 17.78,121.92 | 17.78,121.92 22.86,127 22.86,132.08 | 22.86,132.08 E1.76 | E1.97 17.78,106.68 | 17.78,106.68 17.78,121.92 | 17.78,106.68 27.94,96.52 33.02,96.52 | 33.02,96.52 E1.13 | 33.02,96.52 v53.34,96.52 53.34,99.06 50.8,101.6 v50.8,114.3 | E1.40 E1.37 63.5,111.76 C1.2 63.5,121.92 E1.45
GTF+IND  (via drill 0.81 pad 0.3)
  Top 0.406: J.S1 48.58,200.98 48.26,200.66 v48.26,191.77 | H.A1 73.98,202.25 73.66,201.93 73.66,194.31 v71.12,191.77
  Bottom 0.406: v71.12,191.77 v48.26,191.77
INCR_SC
  Top 0.406: E1.58 44.45,135.89 44.45,143.51 48.26,147.32 64.77,147.32 99.06,181.61 99.06,202.56 H.K1
INIT
  Top 0.406: E1.14 33.02,86.36 36.83,82.55 36.83,68.58 86.36,19.05 86.36,8.89 86.68,8.57 U$1.CR1
INT_IN_PROG  (via drill 0.81 pad 0.25)
  Top 0.406: E1.25 46.99,92.71 46.99,88.9 109.22,26.67 144.78,26.67 v153.67,17.78
  Bottom 0.406: U$1.BP2 153.35,8.57 153.67,8.89 v153.67,17.78
LAST_STEP_L
  Top 0.406: H.C1 80.33,202.25 80.01,201.93 80.01,195.58 78.74,194.31 78.74,176.53 64.77,162.56 48.26,162.56 25.4,139.7 E1.73
MA_MS_LC  (via drill 0.81 pad 0.25)
  Top 0.406: v172.72,17.78 172.72,20.32 88.9,104.14 87.63,105.41 57.15,105.41 E1.32
  Bottom 0.406: U$1.BH2 172.4,8.57 172.72,8.89 v172.72,17.78
MD0
  Top 0.406: U$1.AK1 235.9,8.57 236.22,8.89 236.22,20.32 146.05,110.49 57.15,110.49 E1.38
MD1
  Top 0.406: U$1.AL1 232.73,8.57 232.41,8.89 232.41,20.32 143.51,109.22 E1.35
MD2
  Top 0.406: U$1.AM1 229.87,7.62 229.87,20.32 143.51,107.95 57.15,107.95 E1.34
MD3
  Top 0.406: U$1.AP1 223.2,8.57 223.52,8.89 223.52,20.32 137.16,106.68 E1.33
MD4
  Top 0.406: U$1.BK1 166.05,8.57 166.37,8.89 166.37,20.32 154.94,31.75 109.22,31.75 63.5,77.47 63.5,101.6 60.96,104.14 E1.31
MD5
  Top 0.406: U$1.BL1 162.56,7.62 162.56,20.32 152.4,30.48 109.22,30.48 53.34,86.36 E1.30
MD6
  Top 0.406: U$1.BM1 159.7,8.57 160.02,8.89 160.02,20.32 151.13,29.21 109.22,29.21 49.53,88.9 49.53,92.71 E1.27
MD7
  Top 0.406: E1.26 48.26,88.9 109.22,27.94 146.05,27.94 154.94,19.05 154.94,16.51 153.67,15.24 153.67,8.26 U$1.BP1
MD8
  Top 0.406: U$1.DK1 32.7,14.92 34.29,16.51 34.29,82.55 27.94,88.9 E1.10
MD9
  Top 0.406: U$1.DL1 29.53,8.57 29.21,8.89 29.21,15.24 31.75,17.78 31.75,82.55 25.4,88.9 E1.8
MD10
  Top 0.406: U$1.DM1 26.35,8.57 26.67,8.89 26.67,82.55 20.32,88.9 E1.4
MD11
  Top 0.406: U$1.DP1 20,12.38 20.32,12.7 20.32,87.63 19.05,88.9 19.05,92.71 E1.3
MODEB  (via drill 0.81 pad 0.3)
  Top 0.406: v115.57,191.77 115.57,202.56 H.R1 | E1.78 19.05,135.89 19.05,140.97 44.45,166.37 64.77,166.37 73.66,175.26 v73.66,191.77
  Bottom 0.406: H.A2 73.98,200.98 73.66,200.66 v73.66,191.77 v115.57,191.77
NEXT_LOC
  Top 0.406: E1.52 52.07,135.89 52.07,138.43 60.96,138.43 111.76,189.23 111.76,201.93 112.08,202.25 H.P1
RESTART  (via drill 0.81 pad 0.3)
  Top 0.406: E1.60 41.91,135.89 41.91,143.51 49.53,151.13 66.04,151.13 92.71,177.8 v92.71,189.23 v92.71,193.04 | v57.15,194.31 v57.15,189.23
  Bottom 0.406: H.H2 93.03,202.25 92.71,201.93 v92.71,193.04 | J.V2 58.42,203.2 58.42,195.58 v57.15,194.31 | v57.15,189.23 v92.71,189.23
ROM_11_L  (via drill 0.81 pad 0.3)
  Top 0.406: v83.82,193.04 83.82,187.96 82.55,186.69 82.55,176.53 64.77,158.75 48.26,158.75 29.21,139.7 29.21,135.89 E1.70
  Bottom 0.406: H.D2 83.5,200.98 83.82,200.66 v83.82,193.04
ROM_12_L  (via drill 0.81 pad 0.3)
  Top 0.406: v77.47,193.04 R4.1 76.2,186.69 76.2,175.26 64.77,163.83 48.26,163.83 24.13,139.7 24.13,135.89 E1.74
  Bottom 0.406: H.B2 77.15,202.25 77.47,201.93 v77.47,193.04
ROM_13_L
  Top 0.406: E1.57 45.72,143.51 48.26,146.05 64.77,146.05 102.87,184.15 102.87,200.66 102.55,200.98 H.L1
ROM_14_L
  Top 0.406: H.B1 77.15,200.98 77.47,200.66 77.47,195.58 74.93,193.04 74.93,175.26 64.77,165.1 44.45,165.1 20.32,140.97 E1.77
ROM_15_L  (via drill 0.81 pad 0.3)
  Top 0.406: v87.63,193.04 87.63,182.88 85.09,180.34 85.09,176.53 64.77,156.21 49.53,156.21 33.02,139.7 E1.67
  Bottom 0.406: H.E2 86.68,200.98 86.36,200.66 86.36,194.31 v87.63,193.04
ROM_17_L  (via drill 0.81 pad 0.3)
  Top 0.406: v80.01,193.04 80.01,176.53 64.77,161.29 48.26,161.29 26.67,139.7 26.67,135.89 E1.72
  Bottom 0.406: H.C2 80.33,200.98 80.01,200.66 v80.01,193.04
ROM_22_L
  Top 0.406: E1.59 43.18,143.51 49.53,149.86 66.04,149.86 96.52,180.34 96.52,200.66 96.2,200.98 H.J1
ROM_24_L
  Top 0.406: E1.56 46.99,135.89 46.99,143.51 48.26,144.78 64.77,144.78 105.41,185.42 105.41,202.56 H.M1
RTF  (via drill 0.81 pad 0.3)
  Top 0.406: H.T1 121.6,200.98 121.92,200.66 121.92,195.58 120.65,194.31 v120.65,185.42 120.65,175.26 72.39,127 E1.49 | J.D1 13.65,202.25 13.97,201.93 13.97,191.77 v20.32,185.42
  Bottom 0.406: v20.32,185.42 v120.65,185.42
TCK  (via drill 0.81 pad 0.3)
  Top 0.406: E1.64 38.1,132.08 v39.37,130.81
  Bottom 0.406: v39.37,130.81 67.31,130.81 76.2,121.92 172.72,121.92 SV1.1
TDI
  Bottom 0.406: E1.6 24.13,92.71 163.83,92.71 SV1.9
TDO  (via drill 0.81 pad 0.3)
  Top 0.406: E1.75 21.59,135.89 21.59,130.81 v24.13,128.27
  Bottom 0.406: v24.13,128.27 67.31,128.27 76.2,119.38 172.72,119.38 SV1.3
TMS
  Bottom 0.406: E1.17 38.1,95.25 161.29,95.25 SV1.5
TP1  (via drill 0.81 pad 0.25)
  Top 0.406: v118.11,17.78 118.11,20.32 114.3,24.13 109.22,24.13 44.45,88.9 44.45,92.71 E1.23
  Bottom 0.406: U$1.CD2 118.43,8.57 118.11,8.89 v118.11,17.78
TP2  (via drill 0.81 pad 0.25)
  Top 0.406: v115.57,17.78 115.57,20.32 114.3,21.59 104.14,21.59 39.37,85.72 39.37,92.71 E1.19
  Bottom 0.406: U$1.CE2 115.25,8.57 115.57,8.89 v115.57,17.78
TP2_D  (via drill 0.81 pad 0.3)
  Top 0.406: v90.17,193.04 90.17,177.8 66.04,153.67 49.53,153.67 35.56,139.7 E1.65
  Bottom 0.406: H.F2 89.85,200.98 90.17,200.66 v90.17,193.04
TP3  (via drill 0.81 pad 0.25)
  Top 0.406: v109.22,17.78 106.68,20.32 104.14,20.32 38.1,85.72 E1.18
  Bottom 0.406: U$1.CH2 108.9,8.57 109.22,8.89 v109.22,17.78
TP4  (via drill 0.81 pad 0.25)
  Top 0.406: v105.41,17.78 35.56,87 E1.16
  Bottom 0.406: U$1.CJ2 105.41,7.62 v105.41,17.78
TS3  (via drill 0.81 pad 0.25)
  Top 0.406: v96.52,17.78 96.52,19.05 38.1,77.47 38.1,82.55 34.29,86.36 34.29,92.71 E1.15
  Bottom 0.406: U$1.CM2 96.2,8.57 96.52,8.89 v96.52,17.78
VCC  (via drill 0.81 pad 0.25, 0.81 pad 0.3)
  Top 0.813: VCCIO.1 v49.53,78.74 v87.63,40.64 | v77.47,123.19 v77.47,113.03 VCCINT.1 | v77.47,78.74 v77.47,97.79
  Bottom 0.813: 128.27,40.64 128.27,8.26 U$1.CA2 | v87.63,40.64 C37.+ 128.27,40.64 | U$1.AA2 261.62,8.26 261.62,34.29 C35.+ 191.77,40.64 | U$1.BA2 191.45,8.57 191.77,8.89 191.77,40.64 | 191.77,40.64 C36.+ | C36.+ 128.27,40.64 | R3.2 R4.2 v77.47,123.19 | SV1.4 185.42,109.22 C36.+ | v49.53,78.74 v77.47,78.74 | v77.47,97.79 v77.47,113.03
VCCINT
  Top 0.813: E1.92 E1.90 E1.89 | E1.91 E1.92 | C3.1 E1.92 | E1.89 E1.91 | E1.87 E1.89 | E1.93 E1.91 | VCCINT.2 C1.1 E1.41 | E1.42 E1.89
  Bottom 0.813: E1.41 E1.42
VCCIO  (via drill 0.81 pad 0.3)
  Top 0.813: VCCIO.2 44.45,82.55 C2.1 E1.20 E1.21 43.18,96.52 | C4.1 E1.53 E1.54 v50.8,124.46 | E1.84 E1.83 v33.02,124.46 E1.68 | E1.5 25.4,96.52 43.18,96.52 | E1.36 v53.34,109.22 53.34,99.06 50.8,96.52 43.18,96.52
  Bottom 0.813: v33.02,124.46 v50.8,124.46 53.34,121.92 v53.34,109.22

### Text on the board
Top: FLIP CHIP | SIDE 1 | CS*ABCDEFHJKLMNPRSTUVWXYZ | + | + | +
Bottom: M8340X | SIDE 2 | DECODER AND STEP COUNTER